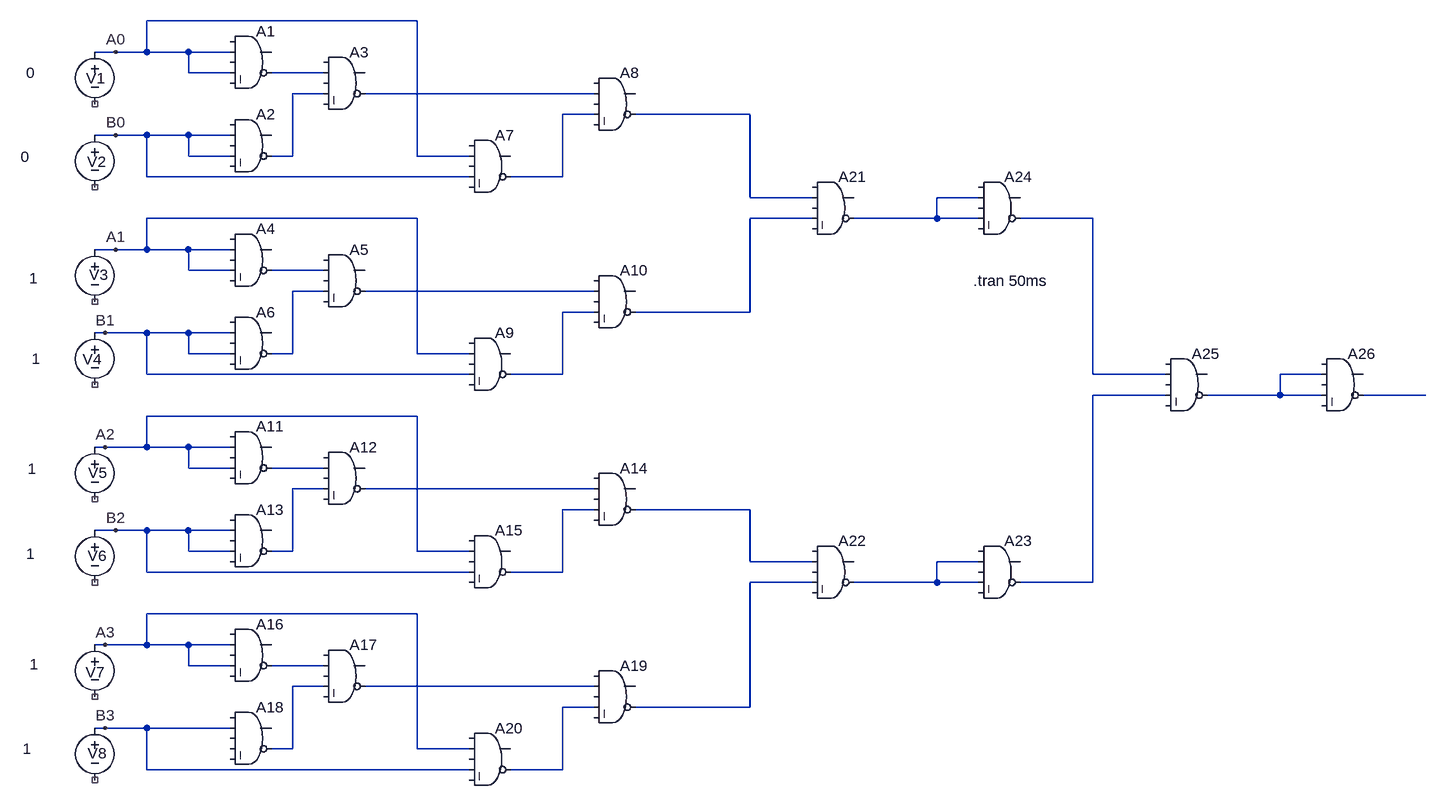
[diagram p0: schematic pregunta3.asc]
pregunta3.asc, the LTspice schematic file:
Version 4
SHEET 1 2116 1232
WIRE 560 48 144 48
WIRE 96 96 64 96
WIRE 144 96 144 48
WIRE 144 96 96 96
WIRE 208 96 144 96
WIRE 272 96 208 96
WIRE 208 128 208 96
WIRE 272 128 208 128
WIRE 416 128 336 128
WIRE 416 160 368 160
WIRE 832 160 480 160
WIRE 832 192 784 192
WIRE 1072 192 896 192
WIRE 96 224 64 224
WIRE 144 224 96 224
WIRE 208 224 144 224
WIRE 272 224 208 224
WIRE 208 256 208 224
WIRE 272 256 208 256
WIRE 368 256 368 160
WIRE 368 256 336 256
WIRE 560 256 560 48
WIRE 640 256 560 256
WIRE 144 288 144 224
WIRE 640 288 144 288
WIRE 784 288 784 192
WIRE 784 288 704 288
WIRE 1072 320 1072 192
WIRE 1168 320 1072 320
WIRE 1424 320 1360 320
WIRE 560 352 144 352
WIRE 1168 352 1072 352
WIRE 1360 352 1360 320
WIRE 1360 352 1232 352
WIRE 1424 352 1360 352
WIRE 1600 352 1488 352
WIRE 96 400 64 400
WIRE 144 400 144 352
WIRE 144 400 96 400
WIRE 208 400 144 400
WIRE 272 400 208 400
WIRE 208 432 208 400
WIRE 272 432 208 432
WIRE 416 432 336 432
WIRE 416 464 368 464
WIRE 832 464 480 464
WIRE 832 496 784 496
WIRE 1072 496 1072 352
WIRE 1072 496 896 496
WIRE 80 528 64 528
WIRE 144 528 80 528
WIRE 208 528 144 528
WIRE 272 528 208 528
WIRE 208 560 208 528
WIRE 272 560 208 560
WIRE 368 560 368 464
WIRE 368 560 336 560
WIRE 560 560 560 352
WIRE 640 560 560 560
WIRE 144 592 144 528
WIRE 640 592 144 592
WIRE 784 592 784 496
WIRE 784 592 704 592
WIRE 1600 592 1600 352
WIRE 1712 592 1600 592
WIRE 1952 592 1888 592
WIRE 1712 624 1600 624
WIRE 1888 624 1888 592
WIRE 1888 624 1776 624
WIRE 1952 624 1888 624
WIRE 2112 624 2016 624
WIRE 560 656 144 656
WIRE 80 704 64 704
WIRE 144 704 144 656
WIRE 144 704 80 704
WIRE 208 704 144 704
WIRE 272 704 208 704
WIRE 208 736 208 704
WIRE 272 736 208 736
WIRE 416 736 336 736
WIRE 416 768 368 768
WIRE 832 768 480 768
WIRE 832 800 784 800
WIRE 1072 800 896 800
WIRE 96 832 64 832
WIRE 144 832 96 832
WIRE 208 832 144 832
WIRE 272 832 208 832
WIRE 208 864 208 832
WIRE 272 864 208 864
WIRE 368 864 368 768
WIRE 368 864 336 864
WIRE 560 864 560 656
WIRE 640 864 560 864
WIRE 1072 880 1072 800
WIRE 1168 880 1072 880
WIRE 1424 880 1360 880
WIRE 144 896 144 832
WIRE 640 896 144 896
WIRE 784 896 784 800
WIRE 784 896 704 896
WIRE 1168 912 1072 912
WIRE 1360 912 1360 880
WIRE 1360 912 1232 912
WIRE 1424 912 1360 912
WIRE 1600 912 1600 624
WIRE 1600 912 1488 912
WIRE 560 960 144 960
WIRE 80 1008 64 1008
WIRE 144 1008 144 960
WIRE 144 1008 80 1008
WIRE 208 1008 144 1008
WIRE 272 1008 208 1008
WIRE 208 1040 208 1008
WIRE 272 1040 208 1040
WIRE 416 1040 336 1040
WIRE 416 1072 368 1072
WIRE 832 1072 480 1072
WIRE 832 1104 784 1104
WIRE 1072 1104 1072 912
WIRE 1072 1104 896 1104
WIRE 80 1136 64 1136
WIRE 144 1136 80 1136
WIRE 272 1136 144 1136
WIRE 368 1168 368 1072
WIRE 368 1168 336 1168
WIRE 560 1168 560 960
WIRE 640 1168 560 1168
WIRE 144 1200 144 1136
WIRE 640 1200 144 1200
WIRE 784 1200 784 1104
WIRE 784 1200 704 1200
FLAG 96 96 A0
FLAG 96 224 B0
FLAG 96 400 A1
FLAG 80 528 B1
FLAG 80 704 A2
FLAG 96 832 B2
FLAG 80 1008 A3
FLAG 80 1136 B3
SYMBOL Digital/and 304 48 R0
SYMATTR InstName A1
SYMBOL Digital/and 448 80 R0
SYMATTR InstName A3
SYMBOL Digital/and 304 176 R0
SYMATTR InstName A2
SYMBOL Digital/and 672 208 R0
SYMATTR InstName A7
SYMBOL Digital/and 864 112 R0
SYMATTR InstName A8
SYMBOL Digital/and 304 352 R0
SYMATTR InstName A4
SYMBOL Digital/and 448 384 R0
SYMATTR InstName A5
SYMBOL Digital/and 304 480 R0
SYMATTR InstName A6
SYMBOL Digital/and 672 512 R0
SYMATTR InstName A9
SYMBOL Digital/and 864 416 R0
SYMATTR InstName A10
SYMBOL Digital/and 304 656 R0
SYMATTR InstName A11
SYMBOL Digital/and 448 688 R0
SYMATTR InstName A12
SYMBOL Digital/and 304 784 R0
SYMATTR InstName A13
SYMBOL Digital/and 864 720 R0
SYMATTR InstName A14
SYMBOL Digital/and 672 816 R0
SYMATTR InstName A15
SYMBOL Digital/and 304 960 R0
SYMATTR InstName A16
SYMBOL Digital/and 448 992 R0
SYMATTR InstName A17
SYMBOL Digital/and 304 1088 R0
SYMATTR InstName A18
SYMBOL Digital/and 864 1024 R0
SYMATTR InstName A19
SYMBOL Digital/and 672 1120 R0
SYMATTR InstName A20
SYMBOL Digital/and 1200 272 R0
SYMATTR InstName A21
SYMBOL Digital/and 1200 832 R0
SYMATTR InstName A22
SYMBOL voltage 64 80 R0
WINDOW 0 -13 56 Left 2
WINDOW 3 -106 48 Left 2
SYMATTR InstName V1
SYMATTR Value 0
SYMBOL voltage 64 208 R0
WINDOW 0 -12 57 Left 2
WINDOW 3 -114 49 Left 2
SYMATTR InstName V2
SYMATTR Value 0
SYMBOL voltage 64 384 R0
WINDOW 0 -9 55 Left 2
WINDOW 3 -101 60 Left 2
SYMATTR InstName V3
SYMATTR Value 1
SYMBOL voltage 64 512 R0
WINDOW 0 -19 57 Left 2
WINDOW 3 -97 56 Left 2
SYMATTR InstName V4
SYMATTR Value 1
SYMBOL voltage 64 688 R0
WINDOW 0 -10 55 Left 2
WINDOW 3 -103 49 Left 2
SYMATTR InstName V5
SYMATTR Value 1
SYMBOL voltage 64 816 R0
WINDOW 0 -11 55 Left 2
WINDOW 3 -106 52 Left 2
SYMATTR InstName V6
SYMATTR Value 1
SYMBOL voltage 64 992 R0
WINDOW 0 -14 58 Left 2
WINDOW 3 -100 46 Left 2
SYMATTR InstName V7
SYMATTR Value 1
SYMBOL voltage 64 1120 R0
WINDOW 0 -11 55 Left 2
WINDOW 3 -111 48 Left 2
SYMATTR InstName V8
SYMATTR Value 1
SYMBOL Digital/and 1456 832 R0
SYMATTR InstName A23
SYMBOL Digital/and 1456 272 R0
SYMATTR InstName A24
SYMBOL Digital/and 1744 544 R0
SYMATTR InstName A25
SYMBOL Digital/and 1984 544 R0
SYMATTR InstName A26
TEXT 1416 448 Left 2 !.tran 50ms

The netlist it stands for:
* pregunta3.asc
A1 0 A0 0 A0 0 N001 0 0 AND
A3 0 N001 0 N002 0 N003 0 0 AND
A2 0 B0 0 B0 0 N002 0 0 AND
A7 0 A0 0 B0 0 N004 0 0 AND
A8 0 N003 0 N004 0 N005 0 0 AND
A4 0 A1 0 A1 0 N009 0 0 AND
A5 0 N009 0 N010 0 N011 0 0 AND
A6 0 B1 0 B1 0 N010 0 0 AND
A9 0 A1 0 B1 0 N012 0 0 AND
A10 0 N011 0 N012 0 N007 0 0 AND
A11 0 A2 0 A2 0 N016 0 0 AND
A12 0 N016 0 N017 0 N018 0 0 AND
A13 0 B2 0 B2 0 N017 0 0 AND
A14 0 N018 0 N019 0 N020 0 0 AND
A15 0 A2 0 B2 0 N019 0 0 AND
A16 0 A3 0 A3 0 N023 0 0 AND
A17 0 N023 0 N024 0 N025 0 0 AND
A18 0 B3 0 0 0 N024 0 0 AND
A19 0 N025 0 N026 0 N022 0 0 AND
A20 0 A3 0 B3 0 N026 0 0 AND
A21 0 N005 0 N007 0 N006 0 0 AND
A22 0 N020 0 N022 0 N021 0 0 AND
V1 A0 NC_01 0
V2 B0 NC_02 0
V3 A1 NC_03 1
V4 B1 NC_04 1
V5 A2 NC_05 1
V6 B2 NC_06 1
V7 A3 NC_07 1
V8 B3 NC_08 1
A23 0 N021 0 N021 0 N014 0 0 AND
A24 0 N006 0 N006 0 N008 0 0 AND
A25 0 N008 0 N014 0 N013 0 0 AND
A26 0 N013 0 N013 0 N015 0 0 AND
.tran 50ms
.backanno
.end